# EAGLE board Harms Professional RAM-16-4b (EAGLE 6.6.0), part 1 of 2
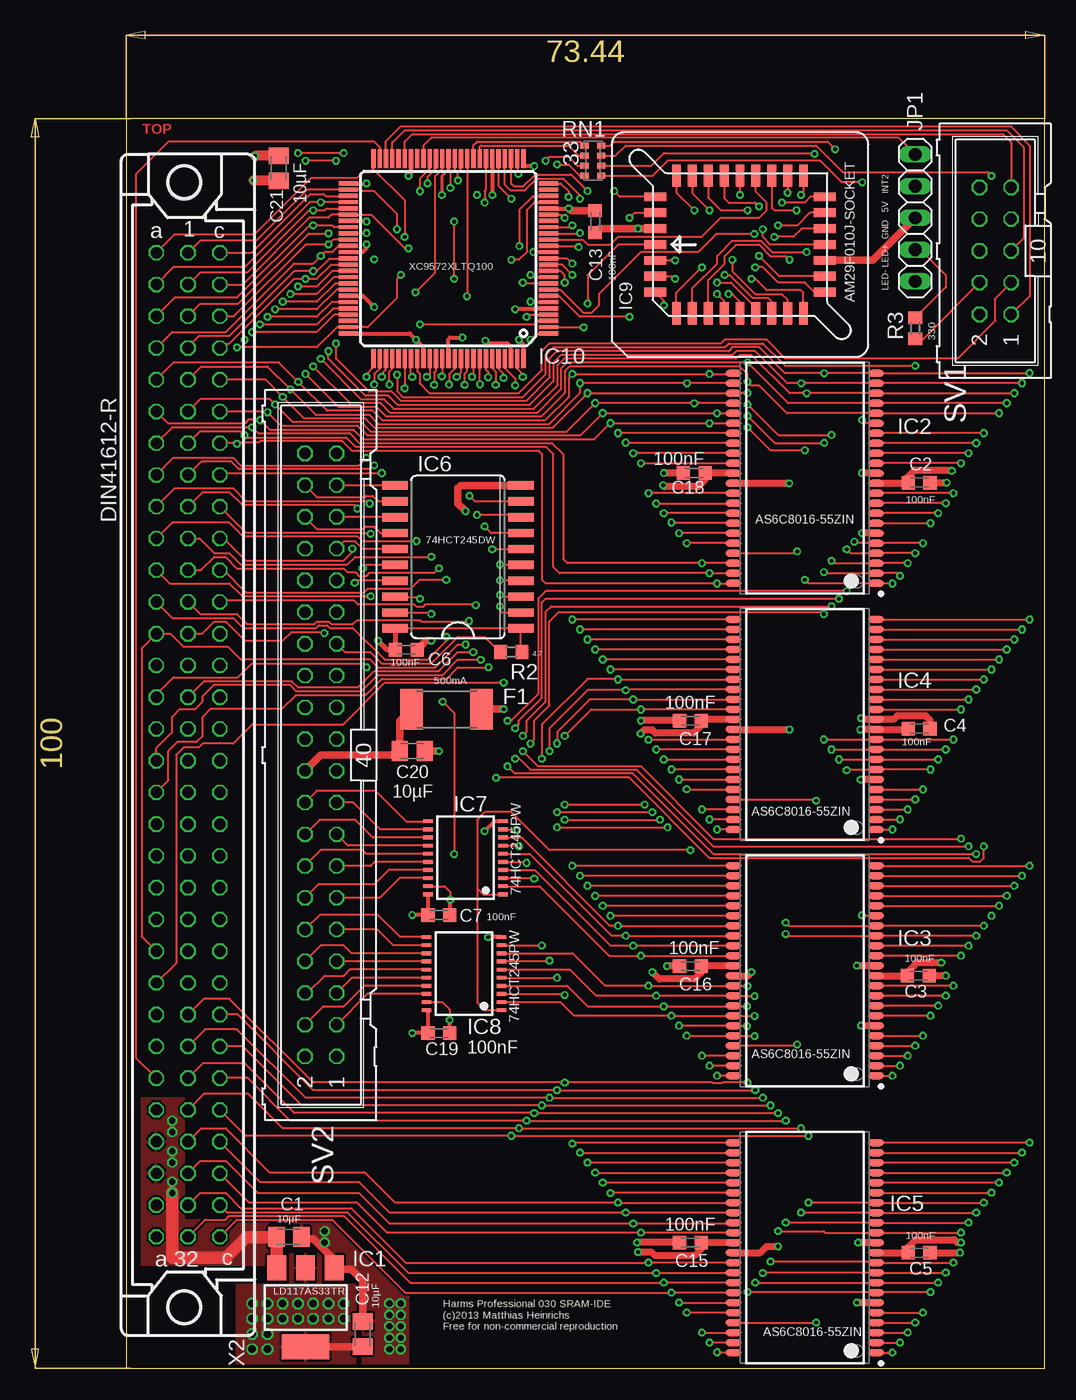
[diagram p2: board, top side]
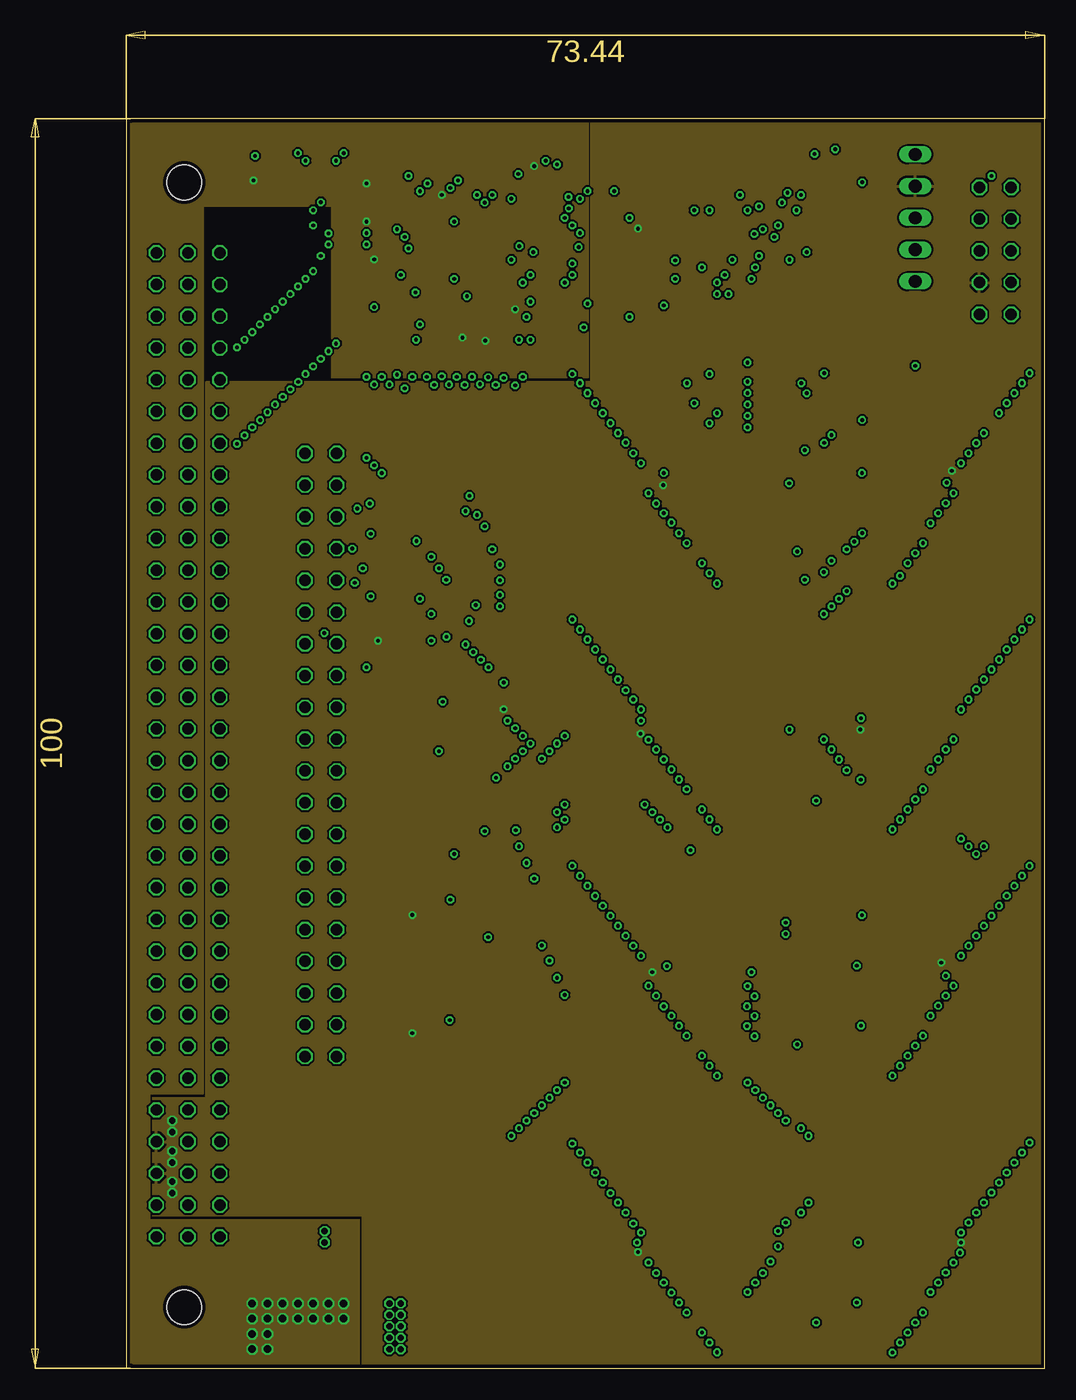
[diagram p3: board, inner layer Route2]
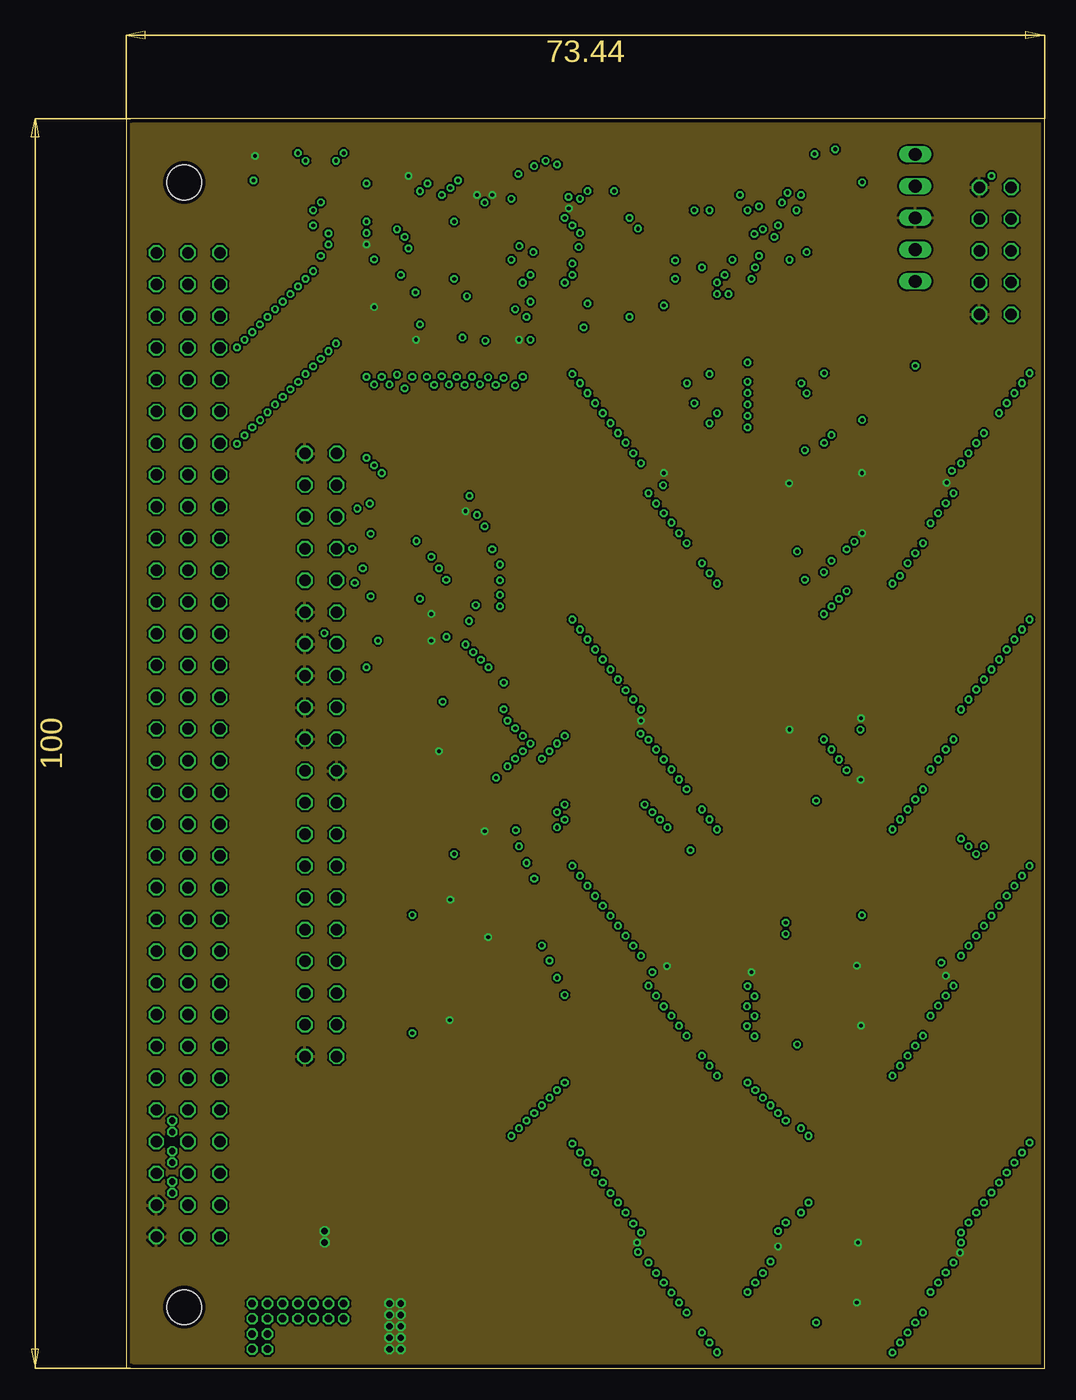
[diagram p4: board, inner layer Route15]
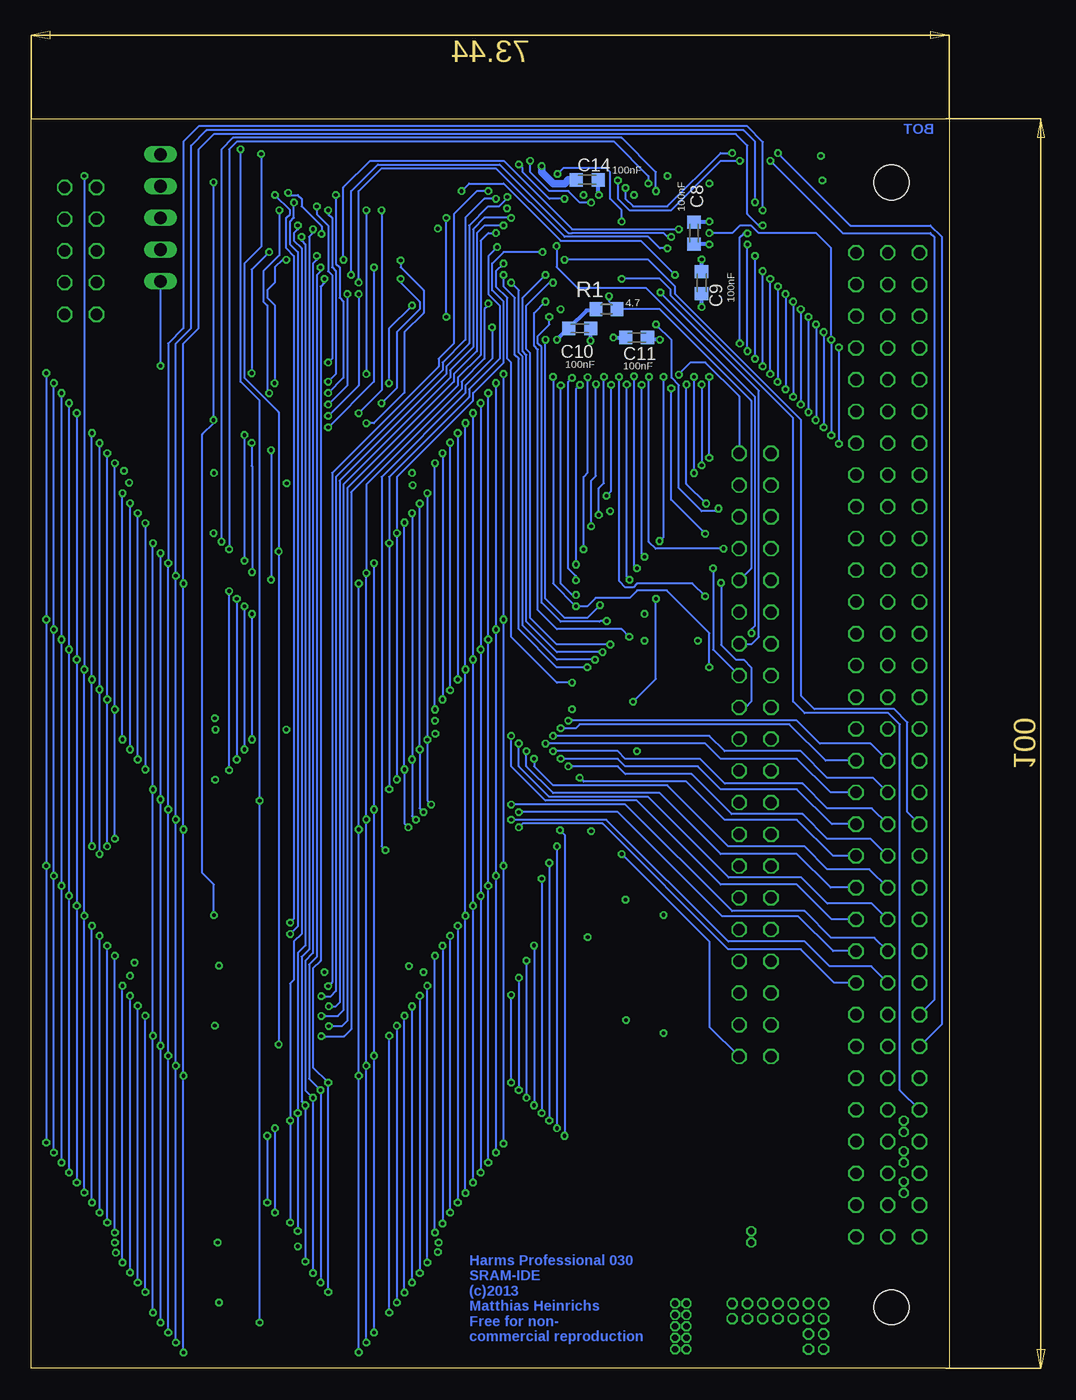
[diagram p5: board, bottom side, seen from below]

Size 73.44 x 100 mm. Coordinates in mm from the lower left corner, seen from the top.
Outline: 0,0 73.44,0 73.44,100 0,100 0,0
Copper layers (1+2*15+16): Top 0.035mm / dielectric 0.36mm / Route2 0.035mm / dielectric 0.71mm / Route15 0.035mm / dielectric 0.36mm / Bottom 0.035mm
Design rules "LeitOn - Standard-Eagle-DRU - 4-Lagen Multilayer - deutsch - Rev 2.0 *": minimum track width 0.15mm, minimum drill 0.3mm, track to track 0.15mm, track to pad 0.15mm, pad to pad 0.15mm, via to via 0.15mm, smd to smd 0.15mm, copper to edge 0.3mm, drill to drill 0.3mm, minimum pad ring 0.15mm, minimum via ring 0.15mm, stop-mask expansion 0.075mm, vias tented up to drill 0mil, thermal gap 0.2mm

## Footprints (pad centres in the part's own frame; a part is rotated, then mirrored left to right if it is on the bottom)
C0805K = smd 1.3 x 1.6: 1 -1,0; 2 1,0
C0603K = smd 1.05 x 1.08: 1 -0.875,0; 2 0.875,0
R2512 = smd 1.8 x 3.2: 1 -2.8,0; 2 2.8,0
SOT223 = smd 1.5 x 2: 1 -2.3,-3.15; 2 0,-3.15; 3 2.3,-3.15 | smd 3.8 x 2: 4 0,3.15
TSOP-2_44 = smd 1.25 x 0.55: 1 -5.7,8.4; 2 -5.7,7.6; 3 -5.7,6.8; 4 -5.7,6; 5 -5.7,5.2; 6 -5.7,4.4; 7 -5.7,3.6; 8 -5.7,2.8; 9 -5.7,2; 10 -5.7,1.2; 11 -5.7,0.4; 12 -5.7,-0.4; 13 -5.7,-1.2; 14 -5.7,-2; 15 -5.7,-2.8; 16 -5.7,-3.6; 17 -5.7,-4.4; 18 -5.7,-5.2; 19 -5.7,-6; 20 -5.7,-6.8; 21 -5.7,-7.6; 22 -5.7,-8.4; 23 5.7,-8.4; 24 5.7,-7.6; 25 5.7,-6.8; 26 5.7,-6; 27 5.7,-5.2; 28 5.7,-4.4; 29 5.7,-3.6; 30 5.7,-2.8; 31 5.7,-2; 32 5.7,-1.2; 33 5.7,-0.4; 34 5.7,0.4; 35 5.7,1.2; 36 5.7,2; 37 5.7,2.8; 38 5.7,3.6; 39 5.7,4.4; 40 5.7,5.2; 41 5.7,6; 42 5.7,6.8; 43 5.7,7.6; 44 5.7,8.4
SO20W = smd 0.66 x 2.032: 1 -5.715,-5.029; 2 -4.445,-5.029; 3 -3.175,-5.029; 4 -1.905,-5.029; 5 -0.635,-5.029; 6 0.635,-5.029; 7 1.905,-5.029; 8 3.175,-5.029; 9 4.445,-5.029; 10 5.715,-5.029; 11 5.715,5.029; 12 4.445,5.029; 13 3.175,5.029; 14 1.905,5.029; 15 0.635,5.029; 16 -0.635,5.029; 17 -1.905,5.029; 18 -3.175,5.029; 19 -4.445,5.029; 20 -5.715,5.029
TSSOP20 = smd 0.3 x 0.75: 1 -2.925,-3; 2 -2.275,-3; 3 -1.625,-3; 4 -0.975,-3; 5 -0.325,-3; 6 0.325,-3; 7 0.975,-3; 8 1.625,-3; 9 2.275,-3; 10 2.925,-3; 11 2.925,3; 12 2.275,3; 13 1.625,3; 14 0.975,3; 15 0.325,3; 16 -0.325,3; 17 -0.975,3; 18 -1.625,3; 19 -2.275,3; 20 -2.925,3
PLCC-32-SMT-TT = smd 0.71 x 1.78: 1 0,6.785; 2 -1.27,6.785; 3 -2.54,6.785; 4 -3.81,6.785; 14 -3.81,-6.785; 15 -2.54,-6.785; 16 -1.27,-6.785; 17 0,-6.785; 18 1.27,-6.785; 19 2.54,-6.785; 20 3.81,-6.785; 30 3.81,6.785; 31 2.54,6.785; 32 1.27,6.785 | smd 1.78 x 0.71: 5 -5.515,5.08; 6 -5.515,3.81; 7 -5.515,2.54; 8 -5.515,1.27; 9 -5.515,0; 10 -5.515,-1.27; 11 -5.515,-2.54; 12 -5.515,-3.81; 13 -5.515,-5.08; 21 5.515,-5.08; 22 5.515,-3.81; 23 5.515,-2.54; 24 5.515,-1.27; 25 5.515,0; 26 5.515,1.27; 27 5.515,2.54; 28 5.515,3.81; 29 5.515,5.08
TQ100 = smd 1.524 x 0.343: 1 -4.19,3.46; 2 -4.19,2.96; 3 -4.19,2.46; 4 -4.19,1.96; 5 -4.19,1.46; 6 -4.19,0.96; 7 -4.19,0.46; 8 -4.19,-0.04; 9 -4.19,-0.54; 10 -4.19,-1.04; 11 -4.19,-1.54; 13 -4.19,-2.54; 14 -4.19,-3.04; 15 -4.19,-3.54; 16 -4.19,-4.04; 17 -4.19,-4.54; 18 -4.19,-5.04; 19 -4.19,-5.54; 20 -4.19,-6.04; 21 -4.19,-6.54; 22 -4.19,-7.04; 23 -4.19,-7.54; 24 -4.19,-8.04; 25 -4.19,-8.54; 51 11.81,-8.54; 52 11.81,-8.04; 53 11.81,-7.54; 54 11.81,-7.04; 55 11.81,-6.54; 56 11.81,-6.04; 57 11.81,-5.54; 58 11.81,-5.04; 59 11.81,-4.54; 60 11.81,-4.04; 61 11.81,-3.54; 62 11.81,-3.04; 63 11.81,-2.54; 64 11.81,-2.04; 65 11.81,-1.54; 66 11.81,-1.04; 67 11.81,-0.54; 68 11.81,-0.04; 69 11.81,0.46; 70 11.81,0.96; 71 11.81,1.46; 72 11.81,1.96; 73 11.81,2.46; 74 11.81,2.96; 75 11.81,3.46 | smd 1.5 x 0.35: 12 -4.19,-2.04 | smd 0.343 x 1.524: 26 -2.19,-10.54; 27 -1.69,-10.54; 28 -1.19,-10.54; 29 -0.69,-10.54; 30 -0.19,-10.54; 31 0.31,-10.54; 32 0.81,-10.54; 33 1.31,-10.54; 34 1.81,-10.54; 35 2.31,-10.54; 36 2.81,-10.54; 37 3.31,-10.54; 38 3.81,-10.54; 39 4.31,-10.54; 40 4.81,-10.54; 41 5.31,-10.54; 42 5.81,-10.54; 43 6.31,-10.54; 44 6.81,-10.54; 45 7.31,-10.54; 46 7.81,-10.54; 47 8.31,-10.54; 48 8.81,-10.54; 49 9.31,-10.54; 50 9.81,-10.54; 76 9.81,5.46; 77 9.31,5.46; 78 8.81,5.46; 79 8.31,5.46; 80 7.81,5.46; 81 7.31,5.46; 82 6.81,5.46; 83 6.31,5.46; 84 5.81,5.46; 85 5.31,5.46; 86 4.81,5.46; 87 4.31,5.46; 88 3.81,5.46; 89 3.31,5.46; 90 2.81,5.46; 91 2.31,5.46; 92 1.81,5.46; 93 1.31,5.46; 94 0.81,5.46; 95 0.31,5.46; 96 -0.19,5.46; 97 -0.69,5.46; 98 -1.19,5.46; 99 -1.69,5.46; 100 -2.19,5.46
1X05 = drill 1.016 long: 1 -5.08,0; 2 -2.54,0; 3 0,0; 4 2.54,0; 5 5.08,0
R0603 = smd 1 x 1.1: 1 -0.85,0; 2 0.85,0
CAY16 = smd 0.5 x 0.65: 1 -1.2,-0.675; 2 -0.4,-0.675; 3 0.4,-0.675; 4 1.2,-0.675; 5 1.2,0.675; 6 0.4,0.675; 7 -0.4,0.675; 8 -1.2,0.675
ML10 = drill 0.914 octagon: 1 -5.08,-1.27; 2 -5.08,1.27; 3 -2.54,-1.27; 4 -2.54,1.27; 5 0,-1.27; 6 0,1.27; 7 2.54,-1.27; 8 2.54,1.27; 9 5.08,-1.27; 10 5.08,1.27
ML40 = drill 0.914 octagon: 1 -24.13,-1.27; 2 -24.13,1.27; 3 -21.59,-1.27; 4 -21.59,1.27; 5 -19.05,-1.27; 6 -19.05,1.27; 7 -16.51,-1.27; 8 -16.51,1.27; 9 -13.97,-1.27; 10 -13.97,1.27; 11 -11.43,-1.27; 12 -11.43,1.27; 13 -8.89,-1.27; 14 -8.89,1.27; 15 -6.35,-1.27; 16 -6.35,1.27; 17 -3.81,-1.27; 18 -3.81,1.27; 19 -1.27,-1.27; 20 -1.27,1.27; 21 1.27,-1.27; 22 1.27,1.27; 23 3.81,-1.27; 24 3.81,1.27; 25 6.35,-1.27; 26 6.35,1.27; 27 8.89,-1.27; 28 8.89,1.27; 29 11.43,-1.27; 30 11.43,1.27; 31 13.97,-1.27; 32 13.97,1.27; 33 16.51,-1.27; 34 16.51,1.27; 35 19.05,-1.27; 36 19.05,1.27; 37 21.59,-1.27; 38 21.59,1.27; 39 24.13,-1.27; 40 24.13,1.27
MABC96R = drill 0.914 octagon: A1 -2.54,39.37; A2 -2.54,36.83; A3 -2.54,34.29; A4 -2.54,31.75; A5 -2.54,29.21; A6 -2.54,26.67; A7 -2.54,24.13; A8 -2.54,21.59; A9 -2.54,19.05; A10 -2.54,16.51; A11 -2.54,13.97; A12 -2.54,11.43; A13 -2.54,8.89; A14 -2.54,6.35; A15 -2.54,3.81; A16 -2.54,1.27; A17 -2.54,-1.27; A18 -2.54,-3.81; A19 -2.54,-6.35; A20 -2.54,-8.89; A21 -2.54,-11.43; A22 -2.54,-13.97; A23 -2.54,-16.51; A24 -2.54,-19.05; A25 -2.54,-21.59; A26 -2.54,-24.13; A27 -2.54,-26.67; A28 -2.54,-29.21; A29 -2.54,-31.75; A30 -2.54,-34.29; A31 -2.54,-36.83; A32 -2.54,-39.37; B1 0,39.37; B2 0,36.83; B3 0,34.29; B4 0,31.75; B5 0,29.21; B6 0,26.67; B7 0,24.13; B8 0,21.59; B9 0,19.05; B10 0,16.51; B11 0,13.97; B12 0,11.43; B13 0,8.89; B14 0,6.35; B15 0,3.81; B16 0,1.27; B17 0,-1.27; B18 0,-3.81; B19 0,-6.35; B20 0,-8.89; B21 0,-11.43; B22 0,-13.97; B23 0,-16.51; B24 0,-19.05; B25 0,-21.59; B26 0,-24.13; B27 0,-26.67; B28 0,-29.21; B29 0,-31.75; B30 0,-34.29; B31 0,-36.83; B32 0,-39.37; C1 2.54,39.37; C2 2.54,36.83; C3 2.54,34.29; C4 2.54,31.75; C5 2.54,29.21; C6 2.54,26.67; C7 2.54,24.13; C8 2.54,21.59; C9 2.54,19.05; C10 2.54,16.51; C11 2.54,13.97; C12 2.54,11.43; C13 2.54,8.89; C14 2.54,6.35; C15 2.54,3.81; C16 2.54,1.27; C17 2.54,-1.27; C18 2.54,-3.81; C19 2.54,-6.35; C20 2.54,-8.89; C21 2.54,-11.43; C22 2.54,-13.97; C23 2.54,-16.51; C24 2.54,-19.05; C25 2.54,-21.59; C26 2.54,-24.13; C27 2.54,-26.67; C28 2.54,-29.21; C29 2.54,-31.75; C30 2.54,-34.29; C31 2.54,-36.83; C32 2.54,-39.37 | hole 2.794: -0.305,45; -0.305,-45

## Placement (x,y rotation side)
C1  10µF  [C0805K]  13,10.52 0 top
C2  100nF  [C0603K]  63.4,70.87 0 top
C3  100nF  [C0603K]  63.32,31.42 0 top
C4  100nF  [C0603K]  63.4,51.18 0 top
C5  100nF  [C0603K]  63.4,9.25 0 top
C6  100nF  [C0603K]  22.38,57.48 0 top
C7  100nF  [C0603K]  24.99,36.27 0 top
C8  100nF  [C0603K]  20.42,90.83 270 bottom
C9  100nF  [C0603K]  19.81,86.87 270 bottom
C10  100nF  [C0603K]  29.57,83.21 180 bottom
C11  100nF  [C0603K]  25.02,82.47 0 bottom
C12  10µF  [C0805K]  18.9,2.74 90 top
C13  100nF  [C0603K]  37.49,91.74 90 top
C14  100nF  [C0603K]  28.96,95.1 0 bottom
C15  100nF  [C0603K]  45.11,10.06 180 top
C16  100nF  [C0603K]  45.11,32.18 180 top
C17  100nF  [C0603K]  45.11,51.82 180 top
C18  100nF  [C0603K]  45.42,71.63 180 top
C19  100nF  [C0603K]  24.99,26.82 0 top
C20  10µF  [C0805K]  22.86,49.38 0 top
C21  10µF  [C0805K]  12.19,96.01 90 top
F1  500mA  [R2512]  25.6,52.73 0 top
IC1  LD117AS33TR  [SOT223]  14.33,4.88 180 top
IC2  AS6C8016-55ZIN  [TSOP-2_44]  54.25,71.22 180 top
IC3  AS6C8016-55ZIN  [TSOP-2_44]  54.25,31.8 180 top
IC4  AS6C8016-55ZIN  [TSOP-2_44]  54.25,51.51 180 top
IC5  AS6C8016-55ZIN  [TSOP-2_44]  54.25,9.65 180 top
IC6  74HCT245DW  [SO20W]  26.52,64.92 90 top
IC7  74HCT245PW  [TSSOP20]  27.13,40.84 90 top
IC8  74HCT245PW  [TSSOP20]  27,31.57 90 top
IC9  AM29F010J-SOCKET  [PLCC-32-SMT-TT]  49.07,89.92 90 top
IC10  XC9572XLTQ100  [TQ100]  29.57,86.26 180 top
JP1  [1X05]  63.09,92.05 90 top
R1  4.7  [R0603]  27.43,84.73 0 bottom
R2  4.7  [R0603]  30.79,57.3 180 top
R3  330  [R0603]  63.09,83.21 90 top
RN1  33  [CAY16]  37.31,96.62 270 top
SV1  [ML10]  69.49,89.41 90 top
SV2  [ML40]  15.54,49.07 90 top
X2  MABC96R  [MABC96R]  4.93,49.89 0 top